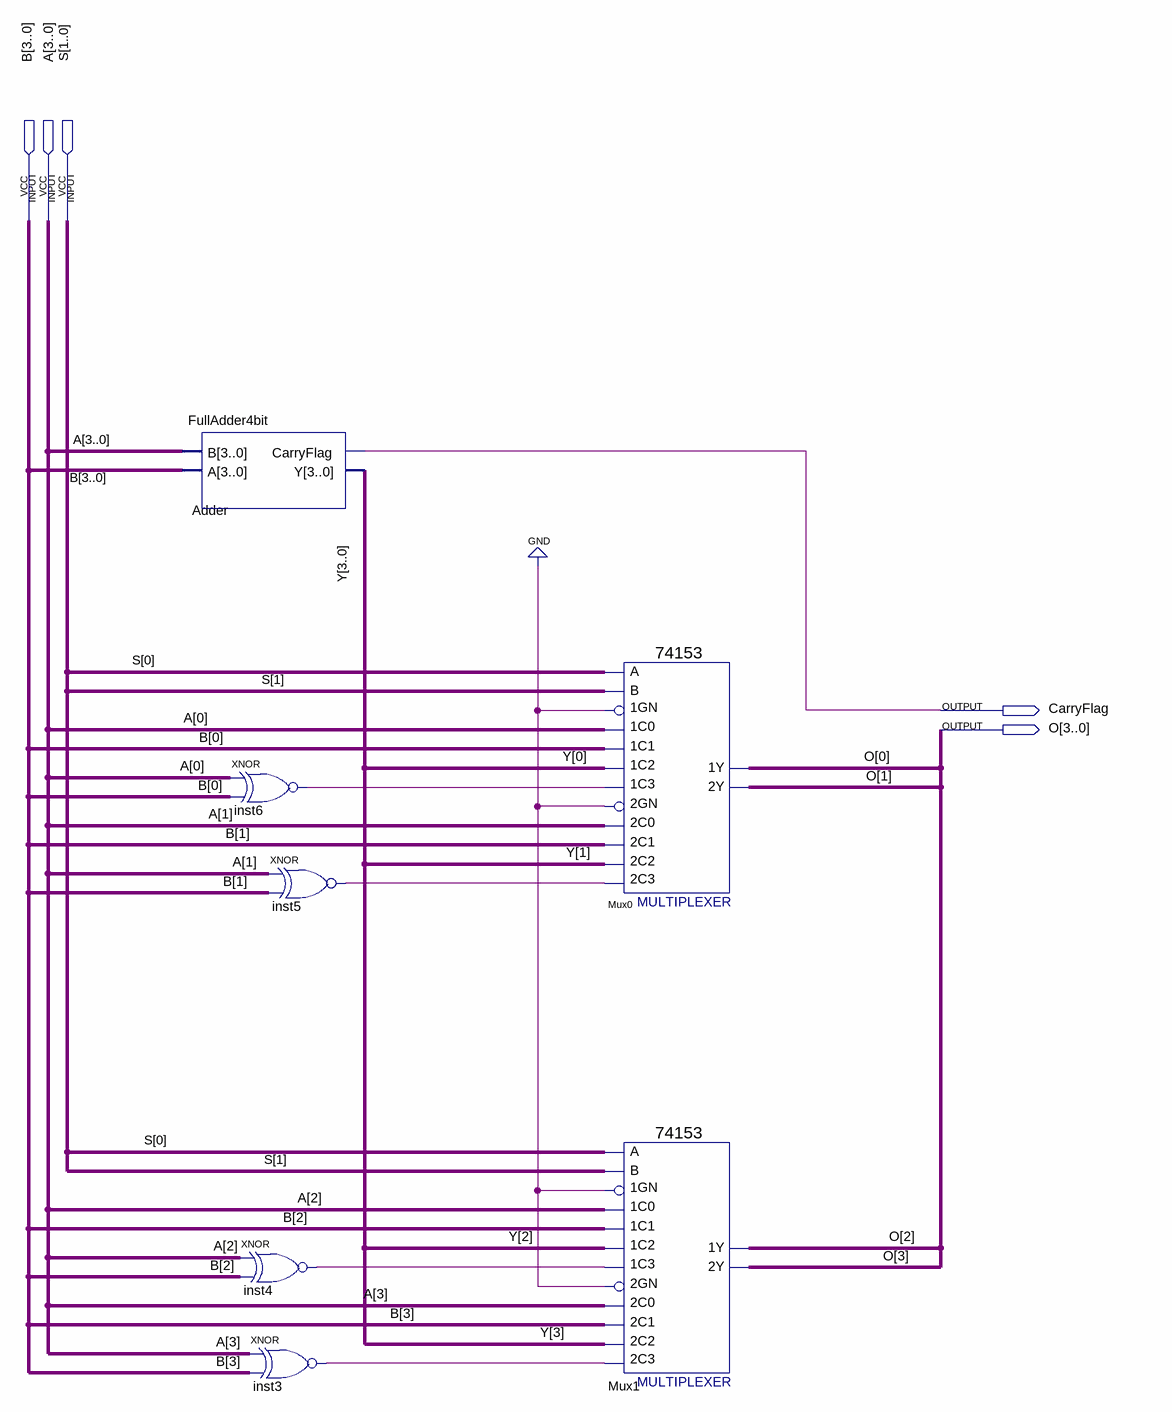
[diagram p0: schematic sheet]
// Quartus schematic Lab1_Preparation.bdf as structural Verilog: 7 symbols, 5 pins
module Lab1_Preparation (
  input  [3:0] B,
  input  [3:0] A,
  input  [1:0] S,
  output CarryFlag,
  output [3:0] O
);

  wire inst3_out, inst4_out, inst5_out, inst6_out;
  wire [3:0] Y;

  FullAdder4bit Adder (.B(A), .A(B), .CarryFlag(CarryFlag), .Y(Y));
  xnor inst6 (inst6_out, A[0], B[0]);
  xnor inst5 (inst5_out, A[1], B[1]);
  xnor inst4 (inst4_out, A[2], B[2]);
  xnor inst3 (inst3_out, A[3], B[3]);
  \74153  Mux0 (
    .\1C1 (B[0]), .\1GN (1'b0), .\1C0 (A[0]), .\2C0 (A[1]), .\2GN (1'b0), .\2C2 (Y[1]), .\1C2 (Y[0]),
    .\1C3 (inst6_out), .B(S[1]), .A(S[0]), .\2C1 (B[1]), .\2C3 (inst5_out), .\1Y (O[0]), .\2Y (O[1]));
  \74153  Mux1 (
    .\1C1 (B[2]), .\1GN (1'b0), .\1C0 (A[2]), .\2C0 (A[3]), .\2GN (1'b0), .\2C2 (Y[3]), .\1C2 (Y[2]),
    .\1C3 (inst4_out), .B(S[1]), .A(S[0]), .\2C1 (B[3]), .\2C3 (inst3_out), .\1Y (O[2]), .\2Y (O[3]));
endmodule
